# Altium schematic sheet SDMMC.SchDoc
size A4; SheetNumber: 10; SheetTotal: 14
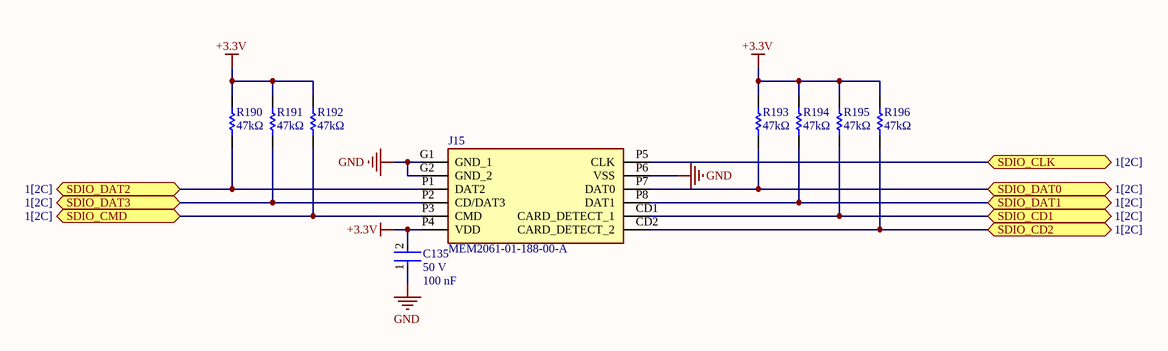
[diagram p0: SDMMC.SchDoc]

## Parts
C135  value 100 nF  Voltage Rating: 50 V  [FP-C0603C-CF-IPC_B]  (hidden comment: C0603C104M5RACTU)
J15  MEM2061-01-188-00-A  [MEM20610118800A]
R190  Resistance: 47kΩ  [RESC1608X55X25ML10T15]  (hidden comment: RC0603FR-1347KL)
R191  Resistance: 47kΩ  [RESC1608X55X25ML10T15]  (hidden comment: RC0603FR-1347KL)
R192  Resistance: 47kΩ  [RESC1608X55X25ML10T15]  (hidden comment: RC0603FR-1347KL)
R193  Resistance: 47kΩ  [RESC1608X55X25ML10T15]  (hidden comment: RC0603FR-1347KL)
R194  Resistance: 47kΩ  [RESC1608X55X25ML10T15]  (hidden comment: RC0603FR-1347KL)
R195  Resistance: 47kΩ  [RESC1608X55X25ML10T15]  (hidden comment: RC0603FR-1347KL)
R196  Resistance: 47kΩ  [RESC1608X55X25ML10T15]  (hidden comment: RC0603FR-1347KL)

## Ports
SDIO_CD1 (bidir, see 1[2C]), SDIO_CD2 (bidir, see 1[2C]), SDIO_CLK (bidir, see 1[2C]), SDIO_CMD (bidir, see 1[2C]), SDIO_DAT0 (bidir, see 1[2C]), SDIO_DAT1 (bidir, see 1[2C]), SDIO_DAT2 (bidir, see 1[2C]), SDIO_DAT3 (bidir, see 1[2C])

## Nets
+3.3V: C135.2 J15.P4(VDD) R190.2 R191.2 R192.2 R193.2 R194.2 R195.2 R196.2
GND: C135.1 J15.G1(GND_1) J15.G2(GND_2) J15.P6(VSS)
SDIO_CD1: J15.CD1(CARD_DETECT_1) R195.1 ; port SDIO_CD1
SDIO_CD2: J15.CD2(CARD_DETECT_2) R196.1 ; port SDIO_CD2
SDIO_CLK: J15.P5(CLK) ; port SDIO_CLK
SDIO_CMD: J15.P3(CMD) R192.1 ; port SDIO_CMD
SDIO_DAT0: J15.P7(DAT0) R193.1 ; port SDIO_DAT0
SDIO_DAT1: J15.P8(DAT1) R194.1 ; port SDIO_DAT1
SDIO_DAT2: J15.P1(DAT2) R190.1 ; port SDIO_DAT2
SDIO_DAT3: J15.P2(CD/DAT3) R191.1 ; port SDIO_DAT3

## Library data of the parts
C135 = CMP-2006-03068-2: CAP CER 0.1UF 50V 20% X7R 0603; Manufacturer: KEMET; Material: Ceramic; Tolerance: 0.2; Temperature Coefficient: 30ppm/°C; Automotive Grade: Grade 1; Capacitance: 0.10 μF; Temperature Range High: +125°C; Device Class L3: Ceramic Capacitors; Manufacturer Part Number: C0603C104M5RACTU; Height: 0.87mm; Category: Cap; RoHS: TRUE; Digikey Description: CAP CER 0.1UF 50V 20% X7R 0603; ComponentLink2URL: https://api.kemet.com/component-edge/download/datasheet/C0603C100J5GACAUTO.pdf; Lead Free: Yes; Temperature Range Low: -55°C; Device Class L1: Passive Components; ComponentLink2Description: Datasheet; Temperature Characteristic: X7R; Automotive: Yes; Temperature: -55°C to +125°C; Octopart: https://octopart.com/c0603c104m5ractu-kemet-11855687; Device Class L2: Capacitors; Package: C0603C-CF; Mouser Description: Multilayer Ceramic Capacitors MLCC - SMD/SMT 50volts 0.1uF X7R 20%
J15 = MEM2061-01-188-00-A: Connector; Manufacturer_Name: GCT (GLOBAL CONNECTOR TECHNOLOGY); Datasheet Link: https://gct.co/files/drawings/mem2061.pdf?v=db251ddb-1946-4f24-aa19-b8a17901bdd2; Height: 2.13mm; Manufacturer_Part_Number: MEM2061-01-188-00-A; Mouser Part Number: 640-MEM20610118800A; Mouser Price/Stock: https://www.mouser.co.uk/ProductDetail/GCT/MEM2061-01-188-00-A?qs=KUoIvG%2F9IlYc25USp0M1eQ%3D%3D
R190-R196 = CMP-2000-04221-1: Manufacturer: Yageo; Part Number: RC0603FR-1347KL